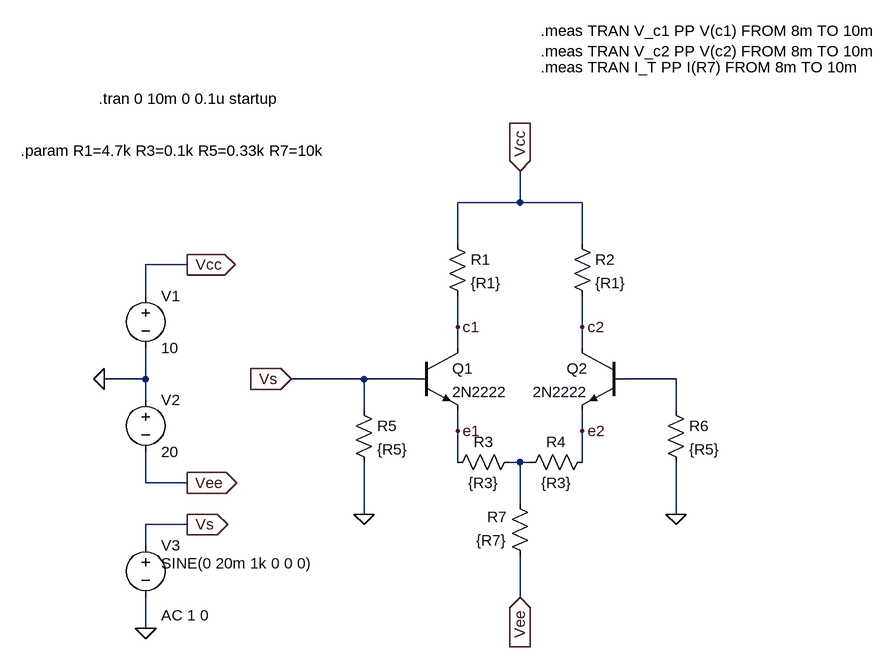
[diagram p0: schematic differential_tran.asc]
differential_tran.asc, the LTspice schematic file:
Version 4
SHEET 1 1068 680
WIRE 448 -176 448 -224
WIRE 448 -176 352 -176
WIRE 544 -176 448 -176
WIRE 352 -112 352 -176
WIRE 544 -112 544 -176
WIRE -64 -80 -128 -80
WIRE -128 -32 -128 -80
WIRE 352 16 352 -32
WIRE 544 16 544 -32
WIRE 352 48 352 16
WIRE 544 48 544 16
WIRE -128 96 -128 48
WIRE -128 96 -192 96
WIRE 208 96 96 96
WIRE 288 96 208 96
WIRE 688 96 608 96
WIRE -128 128 -128 96
WIRE 208 144 208 96
WIRE 688 144 688 96
WIRE 352 176 352 144
WIRE 544 176 544 144
WIRE 352 224 352 176
WIRE 448 224 432 224
WIRE 464 224 448 224
WIRE 544 224 544 176
WIRE -128 256 -128 208
WIRE -64 256 -128 256
WIRE 448 288 448 224
WIRE 208 304 208 224
WIRE 688 304 688 224
WIRE -64 320 -128 320
WIRE -128 352 -128 320
WIRE 448 432 448 368
WIRE -128 480 -128 432
FLAG -192 96 0
FLAG -64 256 Vee
IOPIN -64 256 Out
FLAG -64 -80 Vcc
IOPIN -64 -80 Out
FLAG 448 -224 Vcc
IOPIN 448 -224 In
FLAG 448 432 Vee
IOPIN 448 432 In
FLAG 688 304 0
FLAG 208 304 0
FLAG 352 16 c1
FLAG 544 16 c2
FLAG 352 176 e1
FLAG 544 176 e2
FLAG -128 480 0
FLAG -64 320 Vs
IOPIN -64 320 Out
FLAG 96 96 Vs
IOPIN 96 96 In
SYMBOL npn 288 48 R0
SYMATTR InstName Q1
SYMATTR Value 2N2222
SYMBOL npn 608 48 M0
SYMATTR InstName Q2
SYMATTR Value 2N2222
SYMBOL res 336 -128 R0
SYMATTR InstName R1
SYMATTR Value {R1}
SYMBOL res 528 -128 R0
SYMATTR InstName R2
SYMATTR Value {R1}
SYMBOL res 448 208 R90
WINDOW 0 0 56 VBottom 2
WINDOW 3 32 56 VTop 2
SYMATTR InstName R3
SYMATTR Value {R3}
SYMBOL res 560 208 R90
WINDOW 0 0 56 VBottom 2
WINDOW 3 32 56 VTop 2
SYMATTR InstName R4
SYMATTR Value {R3}
SYMBOL res 464 384 R180
WINDOW 0 36 76 Left 2
WINDOW 3 36 40 Left 2
SYMATTR InstName R7
SYMATTR Value {R7}
SYMBOL voltage -128 -48 R0
WINDOW 123 0 0 Left 0
WINDOW 39 0 0 Left 0
SYMATTR InstName V1
SYMATTR Value 10
SYMBOL voltage -128 112 R0
WINDOW 123 0 0 Left 0
WINDOW 39 0 0 Left 0
SYMATTR InstName V2
SYMATTR Value 20
SYMBOL res 192 128 R0
SYMATTR InstName R5
SYMATTR Value {R5}
SYMBOL res 672 128 R0
SYMATTR InstName R6
SYMATTR Value {R5}
SYMBOL voltage -128 336 R0
WINDOW 123 24 124 Left 2
WINDOW 39 0 0 Left 0
WINDOW 3 24 44 Left 2
SYMATTR Value2 AC 1 0
SYMATTR Value SINE(0 20m 1k 0 0 0)
SYMATTR InstName V3
TEXT -320 -256 Left 2 !.param R1=4.7k R3=0.1k R5=0.33k R7=10k
TEXT -200 -336 Left 2 !.tran 0 10m 0 0.1u startup
TEXT 480 -440 Left 2 !.meas TRAN V_c1 PP V(c1) FROM 8m TO 10m\n.meas TRAN V_c2 PP V(c2) FROM 8m TO 10m
TEXT 480 -384 Left 2 !.meas TRAN I_T PP I(R7) FROM 8m TO 10m

The netlist it stands for:
* differential_tran.asc
Q1 c1 Vs e1 0 2N2222
Q2 c2 N001 e2 0 2N2222
R1 Vcc c1 {R1}
R2 Vcc c2 {R1}
R3 N002 e1 {R3}
R4 e2 N002 {R3}
R7 Vee N002 {R7}
V1 Vcc 0 10
V2 0 Vee 20
R5 Vs 0 {R5}
R6 N001 0 {R5}
V3 Vs 0 SINE(0 20m 1k 0 0 0) AC 1 0
.model NPN NPN
.model PNP PNP
.lib standard.bjt
.param R1=4.7k R3=0.1k R5=0.33k R7=10k
.tran 0 10m 0 0.1u startup
.meas TRAN V_c1 PP V(c1) FROM 8m TO 10m
.meas TRAN V_c2 PP V(c2) FROM 8m TO 10m
.meas TRAN I_T PP I(R7) FROM 8m TO 10m
.backanno
.end